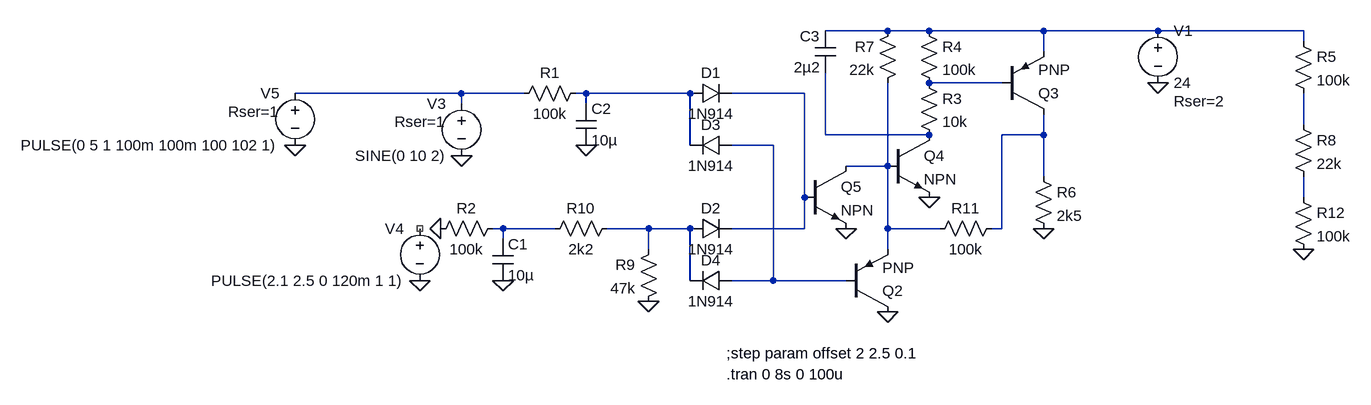
[diagram p0: schematic DC_detection_2.asc]
DC_detection_2.asc, the LTspice schematic file:
Version 4
SHEET 1 1088 680
WIRE -224 -288 -320 -288
WIRE -160 -288 -224 -288
WIRE 16 -288 -160 -288
WIRE 192 -288 16 -288
WIRE 416 -288 192 -288
WIRE 416 -272 416 -288
WIRE 16 -256 16 -288
WIRE -48 -208 -160 -208
WIRE -880 -192 -1136 -192
WIRE -784 -192 -880 -192
WIRE -688 -192 -704 -192
WIRE -528 -192 -688 -192
WIRE -352 -192 -464 -192
WIRE -880 -176 -880 -192
WIRE -688 -176 -688 -192
WIRE 416 -144 416 -192
WIRE -320 -128 -320 -224
WIRE -160 -128 -320 -128
WIRE 16 -128 16 -160
WIRE 16 -128 -48 -128
WIRE -528 -112 -528 -192
WIRE -400 -112 -464 -112
WIRE -224 -80 -224 -208
WIRE -224 -80 -288 -80
WIRE 16 -64 16 -128
WIRE -352 -32 -352 -192
WIRE 416 -32 416 -64
WIRE -816 16 -832 16
WIRE -736 16 -816 16
WIRE -592 16 -656 16
WIRE -528 16 -592 16
WIRE -352 16 -352 -32
WIRE -352 16 -464 16
WIRE -224 16 -224 -80
WIRE -144 16 -224 16
WIRE -48 16 -48 -128
WIRE -48 16 -64 16
WIRE -816 32 -816 16
WIRE -592 48 -592 16
WIRE -224 48 -224 16
WIRE -528 96 -528 16
WIRE -400 96 -400 -112
WIRE -400 96 -464 96
WIRE -288 96 -400 96
FLAG -688 -112 0
FLAG -816 96 0
FLAG -944 96 0
FLAG -880 -96 0
FLAG 192 -208 0
FLAG 16 16 0
FLAG -224 144 0
FLAG -288 16 0
FLAG -160 -32 0
FLAG -912 16 0
FLAG -1136 -112 0
FLAG -592 128 0
FLAG 416 48 0
SYMBOL res -688 -208 R90
WINDOW 0 0 56 VBottom 2
WINDOW 3 32 56 VTop 2
SYMATTR InstName R1
SYMATTR Value 100k
SYMBOL res -816 0 R90
WINDOW 0 0 56 VBottom 2
WINDOW 3 32 56 VTop 2
SYMATTR InstName R2
SYMATTR Value 100k
SYMBOL cap -832 32 R0
SYMATTR InstName C1
SYMATTR Value 10µ
SYMBOL cap -704 -176 R0
SYMATTR InstName C2
SYMATTR Value 10µ
SYMBOL pnp -288 144 M180
SYMATTR InstName Q2
SYMBOL pnp -48 -160 M180
SYMATTR InstName Q3
SYMBOL res -176 -224 R0
SYMATTR InstName R3
SYMATTR Value 10k
SYMBOL res -176 -304 R0
SYMATTR InstName R4
SYMATTR Value 100k
SYMBOL voltage 192 -304 R0
WINDOW 123 0 0 Left 0
WINDOW 39 24 124 Left 2
SYMATTR SpiceLine Rser=2
SYMATTR InstName V1
SYMATTR Value 24
SYMBOL voltage -880 -192 M0
WINDOW 123 0 0 Left 0
WINDOW 39 24 44 Left 2
SYMATTR SpiceLine Rser=1
SYMATTR InstName V3
SYMATTR Value SINE(0 10 2)
SYMBOL voltage -944 0 M0
WINDOW 123 0 0 Left 0
WINDOW 39 0 0 Left 0
SYMATTR InstName V4
SYMATTR Value PULSE(2.1 2.5 0 120m 1 1)
SYMBOL npn -224 -128 R0
SYMATTR InstName Q4
SYMBOL res 0 -80 R0
SYMATTR InstName R6
SYMATTR Value 2k5
SYMBOL res -208 -304 M0
SYMATTR InstName R7
SYMATTR Value 22k
SYMBOL npn -352 -80 R0
SYMATTR InstName Q5
SYMBOL diode -528 -176 R270
WINDOW 0 32 32 VTop 2
WINDOW 3 0 32 VBottom 2
SYMATTR InstName D1
SYMATTR Value 1N914
SYMBOL diode -528 32 R270
WINDOW 0 32 32 VTop 2
WINDOW 3 0 32 VBottom 2
SYMATTR InstName D2
SYMATTR Value 1N914
SYMBOL diode -464 -128 R90
WINDOW 0 0 32 VBottom 2
WINDOW 3 32 32 VTop 2
SYMATTR InstName D3
SYMATTR Value 1N914
SYMBOL diode -464 80 R90
WINDOW 0 0 32 VBottom 2
WINDOW 3 32 32 VTop 2
SYMATTR InstName D4
SYMATTR Value 1N914
SYMBOL cap -304 -288 M0
SYMATTR InstName C3
SYMATTR Value 2µ2
SYMBOL voltage -1136 -208 M0
WINDOW 123 0 0 Left 0
WINDOW 39 24 44 Left 2
SYMATTR InstName V5
SYMATTR Value PULSE(0 5 1 100m 100m 100 102 1)
SYMATTR SpiceLine Rser=1
SYMBOL res -576 32 M0
SYMATTR InstName R9
SYMATTR Value 47k
SYMBOL res -640 0 R90
WINDOW 0 0 56 VBottom 2
WINDOW 3 32 56 VTop 2
SYMATTR InstName R10
SYMATTR Value 2k2
SYMBOL res -48 0 R90
WINDOW 0 0 56 VBottom 2
WINDOW 3 32 56 VTop 2
SYMATTR InstName R11
SYMATTR Value 100k
SYMBOL res 400 -288 R0
SYMATTR InstName R5
SYMATTR Value 100k
SYMBOL res 400 -160 R0
SYMATTR InstName R8
SYMATTR Value 22k
SYMBOL res 400 -48 R0
SYMATTR InstName R12
SYMATTR Value 100k
TEXT -472 240 Left 2 !.tran 0 8s 0 100u
TEXT -472 208 Left 2 !;step param offset 2 2.5 0.1

The netlist it stands for:
* DC_detection_2.asc
R1 N004 N003 100k
R2 N012 0 100k
C1 N012 0 10µ
C2 N004 0 10µ
Q2 0 N009 N010 0 PNP
Q3 N008 N002 N001 0 PNP
R3 N002 N007 10k
R4 N001 N002 100k
V1 N001 0 24 Rser=2
V3 N003 0 SINE(0 10 2) Rser=1
V4 NC_01 0 PULSE(2.1 2.5 0 120m 1 1)
Q4 N007 N010 0 0 NPN
R6 N008 0 2k5
R7 N001 N010 22k
Q5 N010 N005 0 0 NPN
D1 N004 N005 1N914
D2 N013 N005 1N914
D3 N009 N004 1N914
D4 N009 N013 1N914
C3 N001 N007 2µ2
V5 N003 0 PULSE(0 5 1 100m 100m 100 102 1) Rser=1
R9 N013 0 47k
R10 N013 N012 2k2
R11 N008 N010 100k
R5 N001 N006 100k
R8 N006 N011 22k
R12 N011 0 100k
.model D D
.lib standard.dio
.model NPN NPN
.model PNP PNP
.lib standard.bjt
.tran 0 8s 0 100u
;step param offset 2 2.5 0.1
.backanno
.end